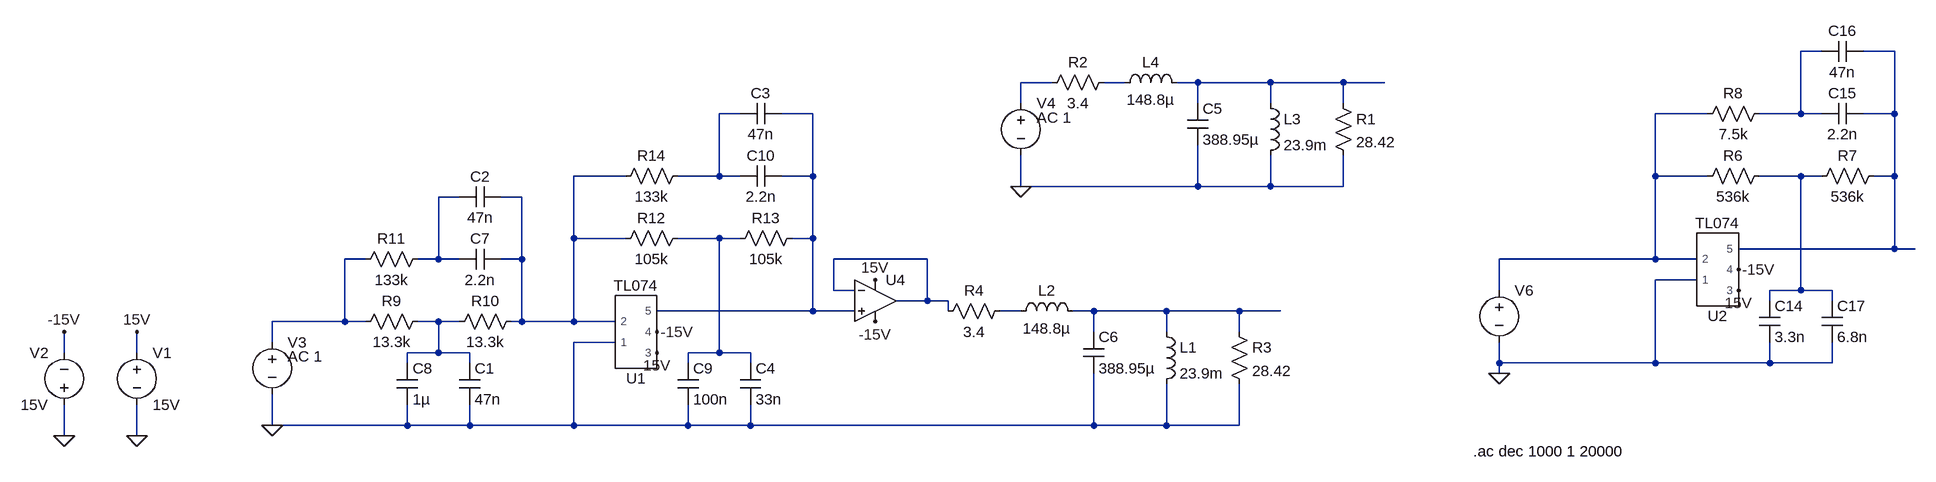
[diagram p0: schematic unmounted_pyle_lt_tl074_bad.asc]
unmounted_pyle_lt_tl074_bad.asc, the LTspice schematic file:
Version 4
SHEET 1 1108 996
WIRE 960 144 928 144
WIRE 1072 144 1024 144
WIRE -224 192 -272 192
WIRE -112 192 -144 192
WIRE 0 192 -32 192
WIRE 112 192 0 192
WIRE 224 192 112 192
WIRE 288 192 224 192
WIRE -272 224 -272 192
WIRE 0 224 0 192
WIRE 112 224 112 192
WIRE 224 224 224 192
WIRE -704 240 -736 240
WIRE -592 240 -640 240
WIRE 784 240 704 240
WIRE 928 240 928 144
WIRE 928 240 864 240
WIRE 960 240 928 240
WIRE 1072 240 1072 144
WIRE 1072 240 1024 240
WIRE -880 336 -960 336
WIRE -736 336 -736 240
WIRE -736 336 -800 336
WIRE -704 336 -736 336
WIRE -592 336 -592 240
WIRE -592 336 -640 336
WIRE 704 336 704 240
WIRE 784 336 704 336
WIRE 928 336 864 336
WIRE 960 336 928 336
WIRE 1072 336 1072 240
WIRE 1072 336 1040 336
WIRE -272 352 -272 304
WIRE 0 352 0 288
WIRE 0 352 -272 352
WIRE 112 352 112 304
WIRE 112 352 0 352
WIRE 224 352 224 304
WIRE 224 352 112 352
WIRE -1136 368 -1168 368
WIRE -1040 368 -1072 368
WIRE -960 432 -960 336
WIRE -880 432 -960 432
WIRE -736 432 -800 432
WIRE -704 432 -736 432
WIRE -592 432 -592 336
WIRE -592 432 -624 432
WIRE 1072 448 1072 336
WIRE 1072 448 832 448
WIRE 1104 448 1072 448
WIRE -1280 464 -1312 464
WIRE -1168 464 -1168 368
WIRE -1168 464 -1200 464
WIRE -1136 464 -1168 464
WIRE -1040 464 -1040 368
WIRE -1040 464 -1072 464
WIRE -416 464 -560 464
WIRE 704 464 704 336
WIRE 704 464 464 464
WIRE 768 464 704 464
WIRE 768 496 704 496
WIRE -560 512 -560 464
WIRE -528 512 -560 512
WIRE 464 512 464 464
WIRE 928 512 928 336
WIRE 928 512 880 512
WIRE 976 512 928 512
WIRE -416 528 -416 464
WIRE -416 528 -464 528
WIRE -384 528 -416 528
WIRE 880 528 880 512
WIRE 976 528 976 512
WIRE -592 544 -592 432
WIRE -592 544 -832 544
WIRE -528 544 -592 544
WIRE -384 544 -384 528
WIRE -272 544 -304 544
WIRE -160 544 -192 544
WIRE -48 544 -160 544
WIRE 64 544 -48 544
WIRE 128 544 64 544
WIRE -1312 560 -1312 464
WIRE -1312 560 -1424 560
WIRE -1280 560 -1312 560
WIRE -1168 560 -1200 560
WIRE -1136 560 -1168 560
WIRE -1040 560 -1040 464
WIRE -1040 560 -1056 560
WIRE -960 560 -960 432
WIRE -960 560 -1040 560
WIRE -896 560 -960 560
WIRE -160 576 -160 544
WIRE -48 576 -48 544
WIRE 64 576 64 544
WIRE -1424 592 -1424 560
WIRE -896 592 -960 592
WIRE -1744 608 -1744 576
WIRE -1632 608 -1632 576
WIRE -1168 608 -1168 560
WIRE -1168 608 -1216 608
WIRE -1120 608 -1168 608
WIRE -736 608 -736 432
WIRE -736 608 -784 608
WIRE -688 608 -736 608
WIRE -1216 624 -1216 608
WIRE -1120 624 -1120 608
WIRE -784 624 -784 608
WIRE -688 624 -688 608
WIRE 464 624 464 592
WIRE 704 624 704 496
WIRE 704 624 464 624
WIRE 880 624 880 592
WIRE 880 624 704 624
WIRE 976 624 976 592
WIRE 976 624 880 624
WIRE 464 640 464 624
WIRE -1424 720 -1424 672
WIRE -1216 720 -1216 688
WIRE -1216 720 -1424 720
WIRE -1120 720 -1120 688
WIRE -1120 720 -1216 720
WIRE -960 720 -960 592
WIRE -960 720 -1120 720
WIRE -784 720 -784 688
WIRE -784 720 -960 720
WIRE -688 720 -688 688
WIRE -688 720 -784 720
WIRE -160 720 -160 640
WIRE -160 720 -688 720
WIRE -48 720 -48 656
WIRE -48 720 -160 720
WIRE 64 720 64 656
WIRE 64 720 -48 720
WIRE -1744 736 -1744 688
WIRE -1632 736 -1632 688
FLAG -1424 720 0
FLAG -1632 576 15V
FLAG -1744 576 -15V
FLAG -1744 736 0
FLAG -1632 736 0
FLAG -832 608 15V
FLAG -272 352 0
FLAG -832 576 -15V
FLAG 832 512 15V
FLAG 832 480 -15V
FLAG 464 640 0
FLAG -496 496 15V
FLAG -496 560 -15V
SYMBOL res -1184 544 R90
WINDOW 0 0 56 VBottom 2
WINDOW 3 32 56 VTop 2
SYMATTR InstName R9
SYMATTR Value 13.3k
SYMBOL res -1040 544 R90
WINDOW 0 0 56 VBottom 2
WINDOW 3 32 56 VTop 2
SYMATTR InstName R10
SYMATTR Value 13.3k
SYMBOL res -1184 448 R90
WINDOW 0 0 56 VBottom 2
WINDOW 3 32 56 VTop 2
SYMATTR InstName R11
SYMATTR Value 133k
SYMBOL cap -1072 448 R90
WINDOW 0 0 32 VBottom 2
WINDOW 3 32 32 VTop 2
SYMATTR InstName C7
SYMATTR Value 2.2n
SYMBOL cap -1232 624 R0
SYMATTR InstName C8
SYMATTR Value 1µ
SYMBOL res -784 416 R90
WINDOW 0 0 56 VBottom 2
WINDOW 3 32 56 VTop 2
SYMATTR InstName R12
SYMATTR Value 105k
SYMBOL cap -800 624 R0
SYMATTR InstName C9
SYMATTR Value 100n
SYMBOL res -608 416 R90
WINDOW 0 0 56 VBottom 2
WINDOW 3 32 56 VTop 2
SYMATTR InstName R13
SYMATTR Value 105k
SYMBOL res -784 320 R90
WINDOW 0 0 56 VBottom 2
WINDOW 3 32 56 VTop 2
SYMATTR InstName R14
SYMATTR Value 133k
SYMBOL cap -640 320 R90
WINDOW 0 0 32 VBottom 2
WINDOW 3 32 32 VTop 2
SYMATTR InstName C10
SYMATTR Value 2.2n
SYMBOL voltage -1424 576 R0
WINDOW 123 24 38 Left 2
WINDOW 39 0 0 Left 0
SYMATTR Value2 AC 1
SYMATTR InstName V3
SYMATTR Value ""
SYMBOL voltage -1632 592 R0
SYMATTR InstName V1
SYMATTR Value 15V
SYMBOL voltage -1744 704 R180
WINDOW 0 24 96 Left 2
WINDOW 3 24 16 Left 2
SYMATTR InstName V2
SYMATTR Value 15V
SYMBOL cap -1136 624 R0
SYMATTR InstName C1
SYMATTR Value 47n
SYMBOL cap -1072 352 R90
WINDOW 0 0 32 VBottom 2
WINDOW 3 32 32 VTop 2
SYMATTR InstName C2
SYMATTR Value 47n
SYMBOL cap -640 224 R90
WINDOW 0 0 32 VBottom 2
WINDOW 3 32 32 VTop 2
SYMATTR InstName C3
SYMATTR Value 47n
SYMBOL cap -704 624 R0
SYMATTR InstName C4
SYMATTR Value 33n
SYMBOL cap -16 224 R0
SYMATTR InstName C5
SYMATTR Value 388.95µ
SYMBOL ind 96 208 R0
SYMATTR InstName L3
SYMATTR Value 23.9m
SYMBOL res 208 208 R0
SYMATTR InstName R1
SYMATTR Value 28.42
SYMBOL res -128 176 R90
WINDOW 0 0 56 VBottom 2
WINDOW 3 32 56 VTop 2
SYMATTR InstName R2
SYMATTR Value 3.4
SYMBOL ind -128 208 R270
WINDOW 0 32 56 VTop 2
WINDOW 3 5 56 VBottom 2
SYMATTR InstName L4
SYMATTR Value 148.8µ
SYMBOL voltage -272 208 R0
WINDOW 123 24 38 Left 2
WINDOW 39 0 0 Left 0
SYMATTR Value2 AC 1
SYMATTR InstName V4
SYMATTR Value ""
SYMBOL AutoGenerated/TL074 -864 576 M180
SYMATTR InstName U1
SYMBOL res 880 320 R90
WINDOW 0 0 56 VBottom 2
WINDOW 3 32 56 VTop 2
SYMATTR InstName R6
SYMATTR Value 536k
SYMBOL cap 864 528 R0
SYMATTR InstName C14
SYMATTR Value 3.3n
SYMBOL res 1056 320 R90
WINDOW 0 0 56 VBottom 2
WINDOW 3 32 56 VTop 2
SYMATTR InstName R7
SYMATTR Value 536k
SYMBOL res 880 224 R90
WINDOW 0 0 56 VBottom 2
WINDOW 3 32 56 VTop 2
SYMATTR InstName R8
SYMATTR Value 7.5k
SYMBOL cap 1024 224 R90
WINDOW 0 0 32 VBottom 2
WINDOW 3 32 32 VTop 2
SYMATTR InstName C15
SYMATTR Value 2.2n
SYMBOL cap 1024 128 R90
WINDOW 0 0 32 VBottom 2
WINDOW 3 32 32 VTop 2
SYMATTR InstName C16
SYMATTR Value 47n
SYMBOL cap 960 528 R0
SYMATTR InstName C17
SYMATTR Value 6.8n
SYMBOL AutoGenerated/TL074 800 480 M180
SYMATTR InstName U2
SYMBOL voltage 464 496 R0
WINDOW 123 24 38 Left 2
WINDOW 39 0 0 Left 0
WINDOW 3 24 60 Left 2
SYMATTR Value ""
SYMATTR InstName V6
SYMBOL cap -176 576 R0
SYMATTR InstName C6
SYMATTR Value 388.95µ
SYMBOL ind -64 560 R0
SYMATTR InstName L1
SYMATTR Value 23.9m
SYMBOL res 48 560 R0
SYMATTR InstName R3
SYMATTR Value 28.42
SYMBOL res -288 528 R90
WINDOW 0 0 56 VBottom 2
WINDOW 3 32 56 VTop 2
SYMATTR InstName R4
SYMATTR Value 3.4
SYMBOL ind -288 560 R270
WINDOW 0 32 56 VTop 2
WINDOW 3 5 56 VBottom 2
SYMATTR InstName L2
SYMATTR Value 148.8µ
SYMBOL Opamps/UniversalOpamp2 -496 528 R0
SYMATTR InstName U4
TEXT 424 760 Left 2 !.ac dec 1000 1 20000

The netlist it stands for:
* unmounted_pyle_lt_tl074_bad.asc
R9 N017 N013 13.3k
R10 N009 N017 13.3k
R11 N011 N013 133k
C7 N009 N011 2.2n
C8 N017 0 1µ
R12 N012 N009 105k
C9 N012 0 100n
R13 N007 N012 105k
R14 N006 N009 133k
C10 N007 N006 2.2n
V3 N013 0 AC 1
V1 15V 0 15V
V2 0 -15V 15V
C1 N017 0 47n
C2 N009 N011 47n
C3 N007 N006 47n
C4 N012 0 33n
C5 N005 0 388.95µ
L3 N005 0 23.9m
R1 N005 0 28.42
R2 N004 N003 3.4
L4 N004 N005 148.8µ
V4 N003 0 AC 1
XU1 0 N009 15V -15V N007 TL074  ; pins 1 2 3 4 5
R6 N010 N008 536k
C14 N010 0 3.3n
R7 N002 N010 536k
R8 N001 N008 7.5k
C15 N002 N001 2.2n
C16 N002 N001 47n
C17 N010 0 6.8n
XU2 0 N008 15V -15V N002 TL074  ; pins 1 2 3 4 5
V6 N008 0
C6 N016 0 388.95µ
L1 N016 0 23.9m
R3 N016 0 28.42
R4 N015 N014 3.4
L2 N015 N016 148.8µ
XU4 N007 N014 15V -15V N014 level.2 Avol=1Meg GBW=10Meg Slew=10Meg ilimit=25m rail=0 Vos=0 phimargin=45 en=0 enk=0 in=0 ink=0 Rin=500Meg  ; pins IN+ IN- V+ V- OUT
.ac dec 1000 1 20000
.lib /Users/sujit/Documents/UNIVERSITY/3rd Year Project/git/3rd-year-project/OpenLoopDesign/Simulations/LTspice/PylePLPW6D/Datasheet/TL074.301
.lib UniversalOpamps2.sub
.backanno
.end